# Altium schematic sheet AC_DC_POWER.SchDoc
size A2; SheetNumber: 1; SheetTotal: 2
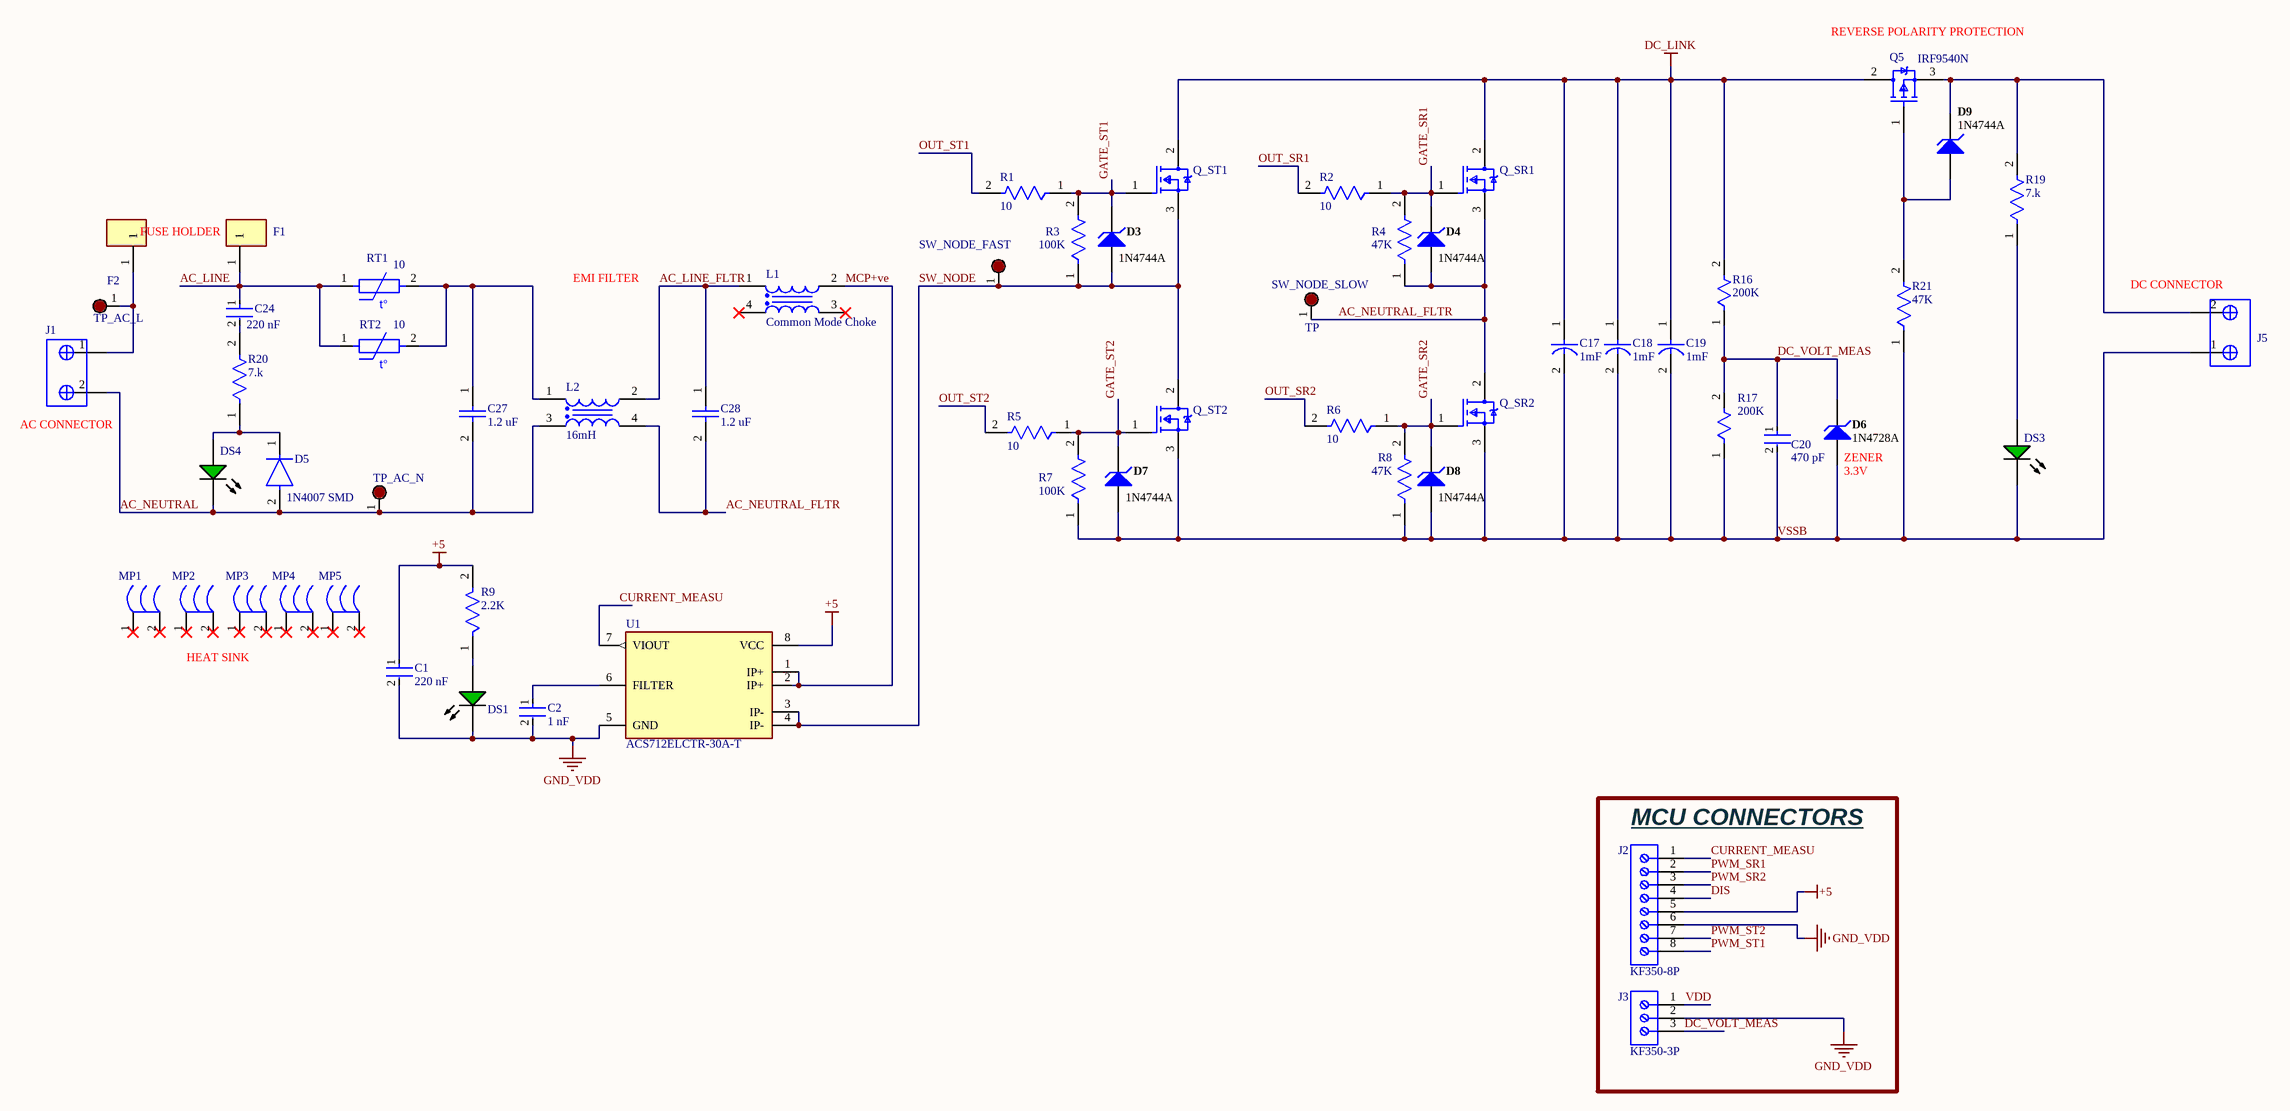
[diagram p0: AC_DC_POWER.SchDoc]

## Parts
C1  220 nF  [FP-C0805C-DN-MFG]
C2  1 nF  [FP-C0805C-DN-MFG]
C17  1mF  [PCBComponent_1]
C18  1mF  [PCBComponent_1]
C19  1mF  [PCBComponent_1]
C20  470 pF  [FP-C0805C-DN-MFG]
C24  220 nF  [FP-C0805C-DN-MFG]
C27  1.2 uF  [PCBComponent_1]
C28  1.2 uF  [PCBComponent_1]
D3  1N4744A  [FAIR-DO-41-2_V]
D4  1N4744A  [FAIR-DO-41-2_V]
D5  1N4007 SMD  [FP-1N4007_SMD-IPC_C]
D6  1N4728A  [FAIR-DO-41-2_V]
D7  1N4744A  [FAIR-DO-41-2_V]
D8  1N4744A  [FAIR-DO-41-2_V]
D9  1N4744A  [FAIR-DO-41-2_V]
DS1  HSMG-C170  [AVAG-HSMX-C170_V]  (value not drawn)
DS3  HSMG-C170  [AVAG-HSMX-C170_V]  (value not drawn)
DS4  HSMG-C170  [AVAG-HSMX-C170_V]  (value not drawn)
F1  0751.0110  [FP-0751_0110-MFG]  (value not drawn)
F2  0751.0110  [FP-0751_0110-MFG]  (value not drawn)
J1  Barrier_2_pins  [PCBComponent_1]  (value not drawn)
J2  KF350-8P  [PCBComponent_1]
J3  KF350-3P  [PCBComponent_1]
J5  Barrier_2_pins  [PCBComponent_1]  (value not drawn)
L1  Common Mode Choke  [PCBComponent_1]
L2  16mH  [PCBComponent_1]
MP1  Heat Sink  [PCBComponent_1]  (value not drawn)
MP2  Heat Sink  [PCBComponent_1]  (value not drawn)
MP3  Heat Sink  [PCBComponent_1]  (value not drawn)
MP4  Heat Sink  [PCBComponent_1]  (value not drawn)
MP5  Heat Sink  [PCBComponent_1]  (value not drawn)
Q5  IRF9540N  [PCBComponent_1]
Q_SR1  IRFP4227PBF  [FP-PG-TO247-3-MFG]  (value not drawn)
Q_SR2  IRFP4227PBF  [FP-PG-TO247-3-MFG]  (value not drawn)
Q_ST1  IRFP4227PBF  [FP-PG-TO247-3-MFG]  (value not drawn)
Q_ST2  IRFP4227PBF  [FP-PG-TO247-3-MFG]  (value not drawn)
R1  10  [FP-RC0805-0_6-IPC_C]
R2  10  [FP-RC0805-0_6-IPC_C]
R3  100K  [FP-RC0805-0_6-IPC_C]
R4  47K  [FP-RC0805-0_6-IPC_C]
R5  10  [FP-RC0805-0_6-IPC_C]
R6  10  [FP-RC0805-0_6-IPC_C]
R7  100K  [FP-RC0805-0_6-IPC_C]
R8  47K  [FP-RC0805-0_6-IPC_C]
R9  2.2K  [FP-RC0805-0_6-IPC_C]
R16  200K  [PCBComponent_1]
R17  200K  [PCBComponent_1]
R19  7.k  [FP-RC0805-0_6-IPC_C]
R20  7.k  [FP-RC0805-0_6-IPC_C]
R21  47K  [FP-RC0805-0_6-IPC_C]
RT1  10  [PCBComponent_1]
RT2  10  [PCBComponent_1]
SW_NODE_FAST  TP  [PCBComponent_1]  (value not drawn)
SW_NODE_SLOW  TP  [PCBComponent_1]
TP_AC_L  AC_LINE  [PCBComponent_1]  (value not drawn)
TP_AC_N  AC_LINE  [PCBComponent_1]  (value not drawn)
U1  ACS712ELCTR-30A-T  [FP-LC-8-IPC_C]

## Blocks framed on the sheet
MCU CONNECTORS: J2 J3

## Nets
+5: C1.1 J2.5 R9.2 U1.8(VCC)
DC_LINK: C17.1 C18.1 C19.1 Q5.2(Drain) Q_SR1.2(DRAIN) Q_ST1.2(DRAIN) R16.2
GND_VDD: C1.2 C2.2 DS1.2(K) J2.6 J3.2 U1.5(GND)
AC_LINE: C24.1 F1.1 RT1.1 RT2.1
AC_LINE_FLTR: C28.1 L1.1 L2.2
AC_NEUTRAL: C27.2 D5.2(A) DS4.2(K) J1.2 L2.3 TP_AC_N.1
AC_NEUTRAL_FLTR: C28.2 D4.1(A) L2.4 Q_SR1.3(SOURCE) Q_SR2.2(DRAIN) R4.1 SW_NODE_SLOW.1
CURRENT_MEASU: J2.1 U1.7(VIOUT)
DC_VOLT_MEAS: C20.1 D6.2(K) J3.3 R16.1 R17.2
DIS: J2.4
GATE_SR1: D4.2(K) Q_SR1.1(GATE) R2.1 R4.2
GATE_SR2: D8.2(K) Q_SR2.1(GATE) R6.1 R8.2
GATE_ST1: D3.2(K) Q_ST1.1(GATE) R1.1 R3.2
GATE_ST2: D7.2(K) Q_ST2.1(GATE) R5.1 R7.2
MCP+ve: L1.2 U1.1(IP+) U1.2(IP+)
OUT_SR1: R2.2
OUT_SR2: R6.2
OUT_ST1: R1.2
OUT_ST2: R5.2
PWM_SR1: J2.2
PWM_SR2: J2.3
PWM_ST1: J2.8
PWM_ST2: J2.7
SW_NODE: D3.1(A) Q_ST1.3(SOURCE) Q_ST2.2(DRAIN) R3.1 SW_NODE_FAST.1 U1.3(IP-) U1.4(IP-)
VDD: J3.1
VSSB: C17.2 C18.2 C19.2 C20.2 D6.1(A) D7.1(A) D8.1(A) DS3.2(K) J5.1 Q_SR2.3(SOURCE) Q_ST2.3(SOURCE) R7.1 R8.1 R17.1 R21.1
NetC2_1: C2.1 U1.6(FILTER)
NetC24_2: C24.2 R20.2
NetC27_1: C27.1 L2.1 RT1.2 RT2.2
NetD5_1: D5.1(C) DS4.1(A) R20.1
NetD9_1: D9.1(A) Q5.1(Gate) R21.2
NetD9_2: D9.2(K) J5.2 Q5.3(Source) R19.2
NetDS1_1: DS1.1(A) R9.1
NetDS3_1: DS3.1(A) R19.1
NetF2_1: F2.1 J1.1 TP_AC_L.1

Not connected (* = marked no-connect by the designer): L1 3* 4(2)*; MP1 1* 2*; MP2 1* 2*; MP3 1* 2*; MP4 1* 2*; MP5 1* 2*

## Notes on the sheet
- (near Q5) REVERSE POLARITY PROTECTION
- (near F2) FUSE HOLDER
- EMI FILTER
- (near J5) DC CONNECTOR
- (near J1) AC CONNECTOR
- (near D6) ZENER
- (near D6) 3.3V
- HEAT SINK
- (in symbol NTC 10-D25) t°

## Library data of the parts
C1 C2 C20 C24 = CMP-1036-04552-2: CAP CER 0.22UF 50V X7R 0805; Manufacturer: KEMET; Manufacturer Part Number: C0805C224K5RACTU; Value: 0.22 μF; Temperature Coefficient: 30ppm/°C; Material: Ceramic; Tolerance: 0.1; ComponentLink2URL: https://content.kemet.com/datasheets/KEM_C1003_C0G_SMD.pdf; Temperature Characteristic: X7R; Device Class L3: Ceramic Capacitors; Lead Free: Yes; Temperature: -55°C to +125°C; RoHS: TRUE; Capacitance: 0.22 μF; Automotive: No; Octopart: https://octopart.com/c0805c224k5ractu-kemet-144670; Temperature Range Low: -55°C; Height: 0.88mm; Device Class L1: Passive Components; Digikey Description: CAP CER 0.22UF 50V X7R 0805; ComponentLink2Description: Datasheet; Mouser Description: CAP CER 0.22UF 50V X7R 0805; Category: Cap; Ipc Land Pattern Name: CAPC200125X78; Temperature Range High: +125°C; Package: C0805C-DN; Device Class L2: Capacitors; Voltage Rating: 50 V
C17-C19 = C
C27 C28 = H124K: H124K / 450MPPN
D3 D4 D7-D9 = CMP-0892-00005-1: Zener Diode, 15V, 1W, 5%, -65 to 200 degC, 2-Pin DO-41, Body 2.72 x 5.2 mm, RoHS; Manufacturer: Fairchild Semiconductor; Test Current IZ (mA): 17; PD (W): 1; IR (uA): 5; VZ (Min.) (V): 14.25; VZ (Max.) (V): 15.75; ZZ (Max) (ohm): 10; PackageReference: DO-41-2; ComponentLink1URL: http://www.fairchildsemi.com/; ComponentLink2URL: http://www.fairchildsemi.com/ds/1N/1N4744A.pdf; ComponentLink3Description: Package Specification; PackageDescription: 2-Pin Axial leaded, Body 2.72 x 5.2 mm, Lead Spread 25.4 mm; ComponentLink2Description: Datasheet; PackageVersion: Rev. 2; ComponentLink3URL: http://www.fairchildsemi.com/dwg/DO/DO41A.pdf; Operating and Storage Temperature Range: -65 to 200 degC; PartNumber: 1N4744A; ComponentLink1Description: Manufacturer URL; DatasheetVersion: Rev. H3; RoHS: TRUE; Tolerance: 5%; Mounting Technology: Through Hole
D5 = CMP-12389-000001-1: Rectifier, 1Kv, 1A, Do-214Ac Rohs Compliant: Yes
D6 = CMP-0892-00028-1: Zener Diode, 3.3V, 1W, 5%, -65 to 200 degC, 2-Pin DO-41, Body 2.72 x 5.2 mm, RoHS; Manufacturer: Fairchild Semiconductor; PD (W): 1; VZ (Max.) (V): 3.465; IR (uA): 100; ZZ (Max) (ohm): 10; Test Current IZ (mA): 76; VZ (Min.) (V): 3.135; DatasheetVersion: Rev. H3; Tolerance: 5%; ComponentLink3URL: http://www.fairchildsemi.com/dwg/DO/DO41A.pdf; ComponentLink2Description: Datasheet; PackageDescription: 2-Pin Axial leaded, Body 2.72 x 5.2 mm, Lead Spread 25.4 mm; PartNumber: 1N4728A; Operating and Storage Temperature Range: -65 to 200 degC; Mounting Technology: Through Hole; ComponentLink3Description: Package Specification; PackageReference: DO-41-2; ComponentLink1URL: http://www.fairchildsemi.com/; RoHS: TRUE; ComponentLink1Description: Manufacturer URL; ComponentLink2URL: http://www.fairchildsemi.com/ds/1N/1N4744A.pdf; PackageVersion: Rev. 2
DS1 DS3 DS4 = CMP-2000-05062-1: Chip LED, Green, 2.2 V, -40 to 85 degC, 2-Pin SMD, Pb-Free, Tape and Reel; Manufacturer: Avago; No. of Pins: 2; Peak Wavelength: 570nm; SVHC: NoSVHC(16-Jun-2014); Dominant Wavelength: 572nm; Forward Current If: 20mA; Viewing Angle: 170deg; Lens Shape: Rectangular; PIV Max: 5V; External Width: 1.25mm; LED Type: Standard; External Depth: 0.8mm; Opto Mounting Orientation: Top; Luminous Intensity: 15mcd; Luminous Intensity Min: 4mcd; Forward Voltage VF Max: 2.6V; External Length / Height: 2mm; Bulb Size: 1.25mmx1.4mm; Light Area Height: 1mm; Voltage Vf Typ: 2.2V; Operating Temperature Max: 85degC; Datasheet Version: Oct-08; MSL: MSL2A-4weeks; Peak Forward Current: 20mA; Package Description: 2-Pin Surface Mount Device, Body 2 x 1.25 mm, Height 0.8 mm; Datasheet URL: https://datasheet.ciiva.com/29280/180495-da-01-en-chip-led-hsmg-c170-gelb-gruen-29280971.pdf; Storage Temperature Min: -40degC; LED Colour: Green; Wavelength Typ: 570nm; Mounting Type: SMD; Forward Current If Max: 20mA; Dominant Wavelength Typ: 572nm; LED Mounting: SMD; Operating Temperature Range: -30degCto+85degC; Operating Temperature Min: -30degC; Manufacturer URL: http://www.avagotech.com/; Packaging: CutTape; Luminous Intensity Typ: 15mcd; Package Reference: HSMX-C170; Storage Temperature Max: 85degC; Opto Case Style: SMD; Forward Voltage: 2.2V
F1 F2 = CMP-26292-000006-1: FUSE CLIP CARTRIDGE 10A PCB; Manufacturer: Schurter; Conn Orientation: Horizontal; Voltage Rating Ac: 500V; Number Of Fuses: 1; ComponentLink2Description: Datasheet; ComponentLink2URL: https://us.schurter.com/bundles/snceschurter/epim/_ProdPool_/newDS/en/typ_OG__Clip__5x20.pdf; Package: 0; Device Class L1: Circuit Protection; Lead Free: Yes; RoHS: TRUE; Voltage Rating Dc: 500V; Device Class L3: unset; Ambient Temperature Range Low: -40°C; Manufacturer Part Number: 0751.0110; Device Class L2: Fuse Holders; Octopart: https://octopart.com/0751.0110-schurter-19402; Height: 8.9mm; Digikey Description: FUSE CLIP CARTRIDGE 10A PCB; Ambient Temperature Range High: +85°C; Category: Fuse; Fuse Current: 10A; Automotive: No
L1 = T60405-R6123-X425: Datasheet: https://eu.mouser.com/datasheet/2/599/6123-X425-240794.pdf
L2 = Choke: Common Mode Choke / Each Coil inductance = 16mH
Q_SR1 Q_SR2 Q_ST1 Q_ST2 = CMP-32901-000878-1: MOSFET N-CH 200V 65A TO247AC; Rds On Max: 25mR; Element Configuration: Single; Turn-On Delay Time: 33ns; Threshold Voltage: 5V; Input Capacitance: 4.6nF; Max Power Dissipation: 330W; Gate to Source Voltage (Vgs): 30V; Lead Free: Lead Free; Packaging: Rail/Tube; Case/Package: TO-247; Series: HEXFET®; Length: 0.625inch; Max Operating Temperature: 175°C; REACH SVHC: No SVHC; Contact Plating: Tin; RoHS Compliant: Yes; Continuous Drain Current (ID): 65A; Drain to Source Voltage (Vdss): 200V; Height: 0.815inch; Max Dual Supply Voltage: 200V; Halogen Free: Not Halogen Free; Width: 0.209inch; Power Dissipation: 330W; Mount: Through Hole; Number of Pins: 3; Min Operating Temperature: -40°C
R1-R9 R19 R20 = CMP-2100-03668-5: RES 100K OHM 1% 1/8W 0805; Power Rating: 125mW; Temperature Coefficient: 100ppm/°C; Voltage Rating (DC): 150V; Resistance: 100kR; Package Quantity: 1; Case/Package: 0805; Lead Pitch: 0.4mm; Case Code (Imperial): 0805; Construction: Rectangular; Number of Terminations: 2; RoHS Compliant: Yes; Max Power Dissipation: 125mW; Tolerance: 1%; Max Operating Temperature: 155°C; Resistance Tolerance: 1%; Lead Free: Lead Free; Packaging: Tape and Reel; Resistor Type: Thick Film; Min Operating Temperature: -55°C; Case Code (Metric): 2012; Series: RC; Technology: THICK FILM; Voltage Rating: 150V; Termination: SMD/SMT; Width: 0.049inch; Number of Pins: 2; Features: Moisture Resistant; Military Standard: Not; Length: 0.079inch; Depth: 1.25mm; Size Code: 0805; Height: 0.024inch
R16 R17 = RES
R21 = CMP-2100-03668-5: RES 47K OHM 1% 1/8W 0805; Power Rating: 125mW; Temperature Coefficient: 100ppm/°C; Voltage Rating (DC): 150V; Resistance: 100kR; Package Quantity: 1; Case/Package: 0805; Lead Pitch: 0.4mm; Case Code (Imperial): 0805; Construction: Rectangular; Number of Terminations: 2; RoHS Compliant: Yes; Max Power Dissipation: 125mW; Tolerance: 1%; Max Operating Temperature: 155°C; Resistance Tolerance: 1%; Lead Free: Lead Free; Packaging: Tape and Reel; Resistor Type: Thick Film; Min Operating Temperature: -55°C; Case Code (Metric): 2012; Series: RC; Technology: THICK FILM; Voltage Rating: 150V; Termination: SMD/SMT; Width: 0.049inch; Number of Pins: 2; Features: Moisture Resistant; Military Standard: Not; Length: 0.079inch; Depth: 1.25mm; Size Code: 0805; Height: 0.024inch
RT1 RT2 = NTC 10-D25: 10Ω 7A 7.5W ±20% 3200K ±10% Plugin,P=10mm NTC Thermistors ROHS
SW_NODE_FAST SW_NODE_SLOW TP_AC_L TP_AC_N = TP: Test Point, Miniature, Red, TH
U1 = CMP-2000-04990-2: SENSOR CURRENT HALL 30A AC/DC; Bandwidth: 80kHz; Max Supply Current: 13mA; Linearity: 1.5%; Operating Supply Voltage: 5V; Quiescent Current: 10mA; Number of Channels: 1; Polarity: Bidirectional; Min Supply Voltage: 4.5V; Response Time: 5us; Sensitivity: 66mV/A; Max Supply Voltage: 5.5V; Current Sensing: 30A; REACH SVHC: No SVHC; Mount: Surface Mount; Max Operating Temperature: 85°C; Packaging: Cut Tape; Frequency: 80kHz; Series: -; Termination: SMD/SMT; RoHS Compliant: Yes; Number of Pins: 8; Package Quantity: 1; Accuracy: 1.5%; Lead Free: Lead Free; Case/Package: SOIC; Min Operating Temperature: -40°C; Output Current: 10mA